# Altium schematic sheet Top_Level.SchDoc
size A4; DocumentNumber: 1; SheetNumber: 1; SheetTotal: 5
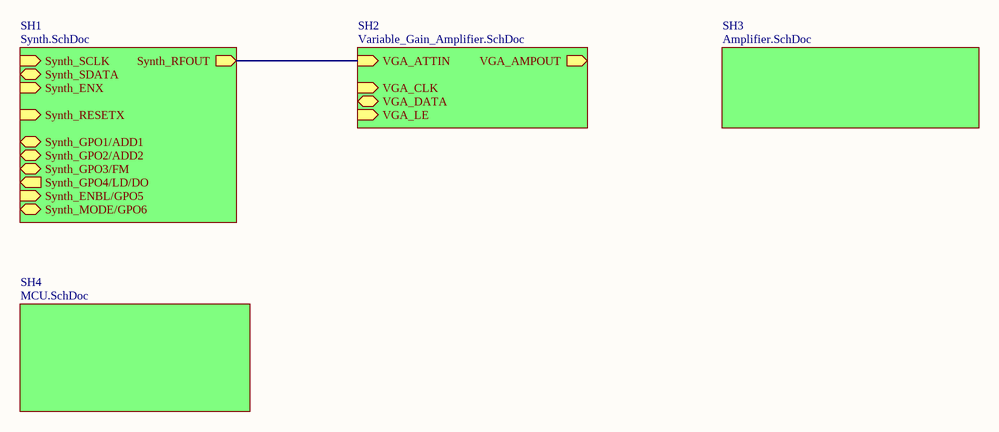
[diagram p0: Top_Level.SchDoc]

## Sub-sheets
SH1 = Synth.SchDoc: Synth_RESETX (in), Synth_ENX (in), Synth_SCLK (in), Synth_SDATA, Synth_ENBL/GPO5 (in), Synth_GPO4/LD/DO (out), Synth_RFOUT (out), Synth_GPO3/FM (bidir), Synth_GPO1/ADD1 (bidir), Synth_GPO2/ADD2 (bidir), Synth_MODE/GPO6 (bidir)
SH2 = Variable_Gain_Amplifier.SchDoc: VGA_AMPOUT (out), VGA_CLK (in), VGA_DATA, VGA_LE (in), VGA_ATTIN (in)
SH3 = Amplifier.SchDoc: no entries
SH4 = MCU.SchDoc: no entries

## Nets
(unnamed): sheet SH1/Synth_RFOUT, sheet SH2/VGA_ATTIN